# EAGLE board uTTA_V1_Measure (EAGLE 6.3)
VERSION: 1.00
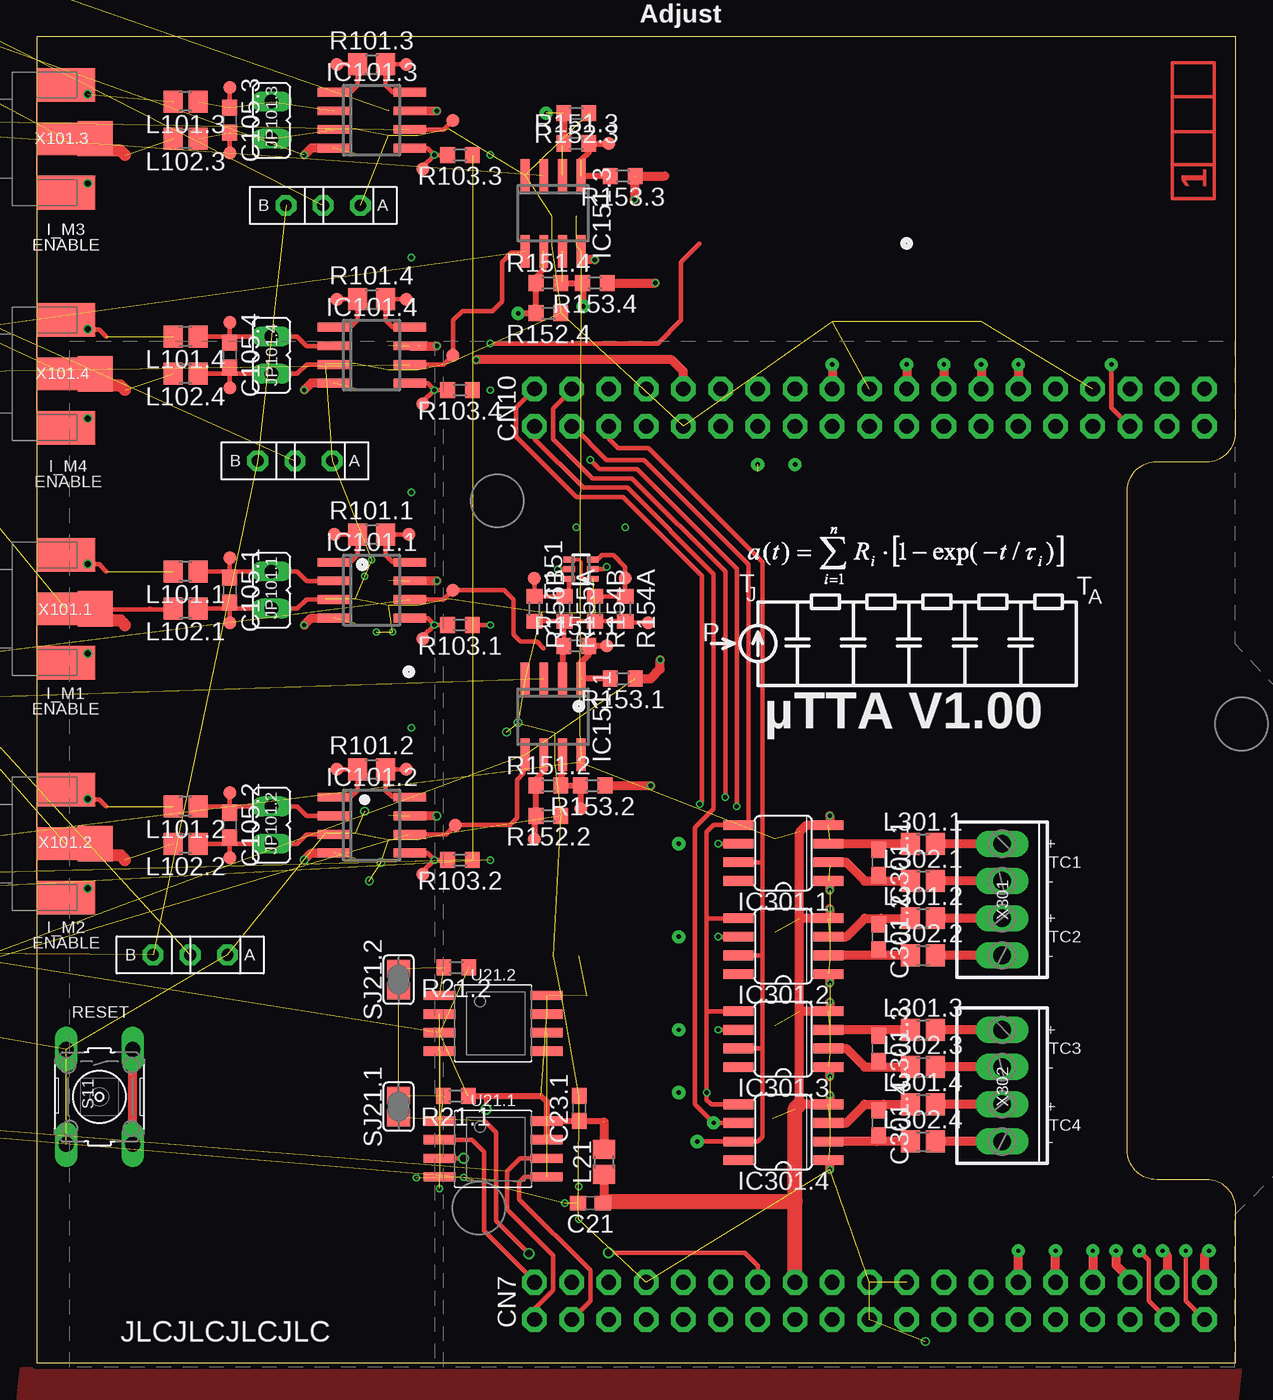
[diagram p5: board, top side]
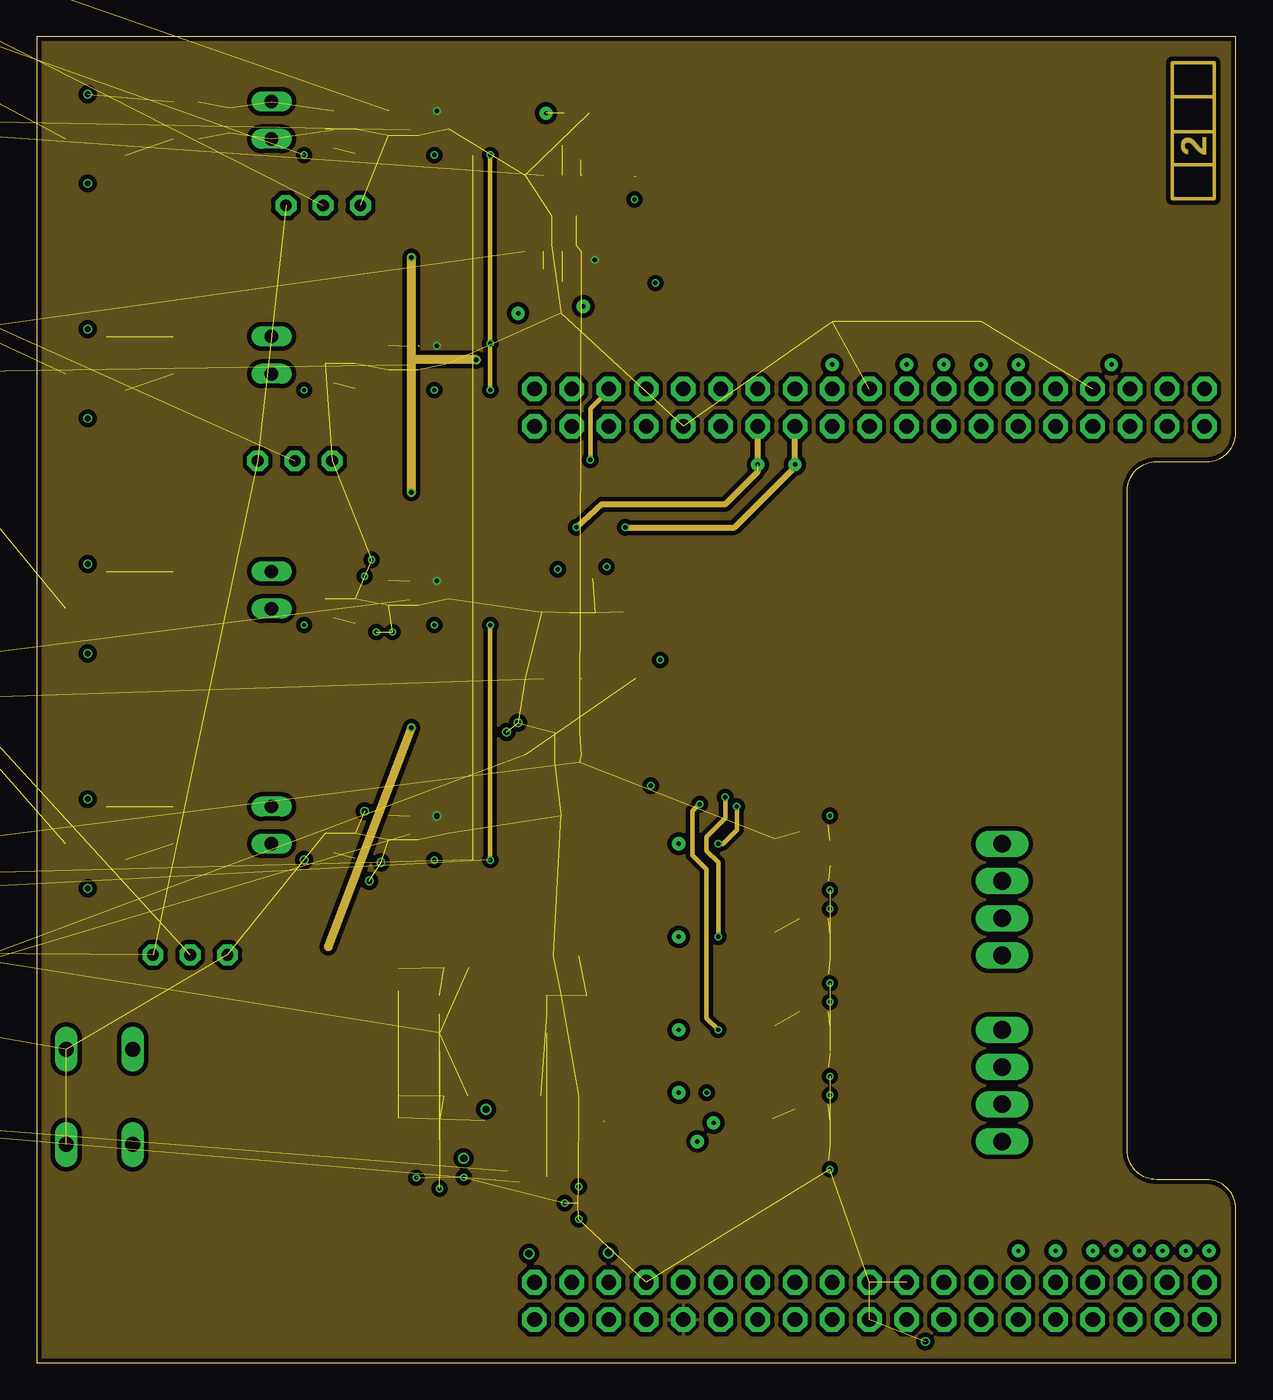
[diagram p6: board, inner layer Route2]
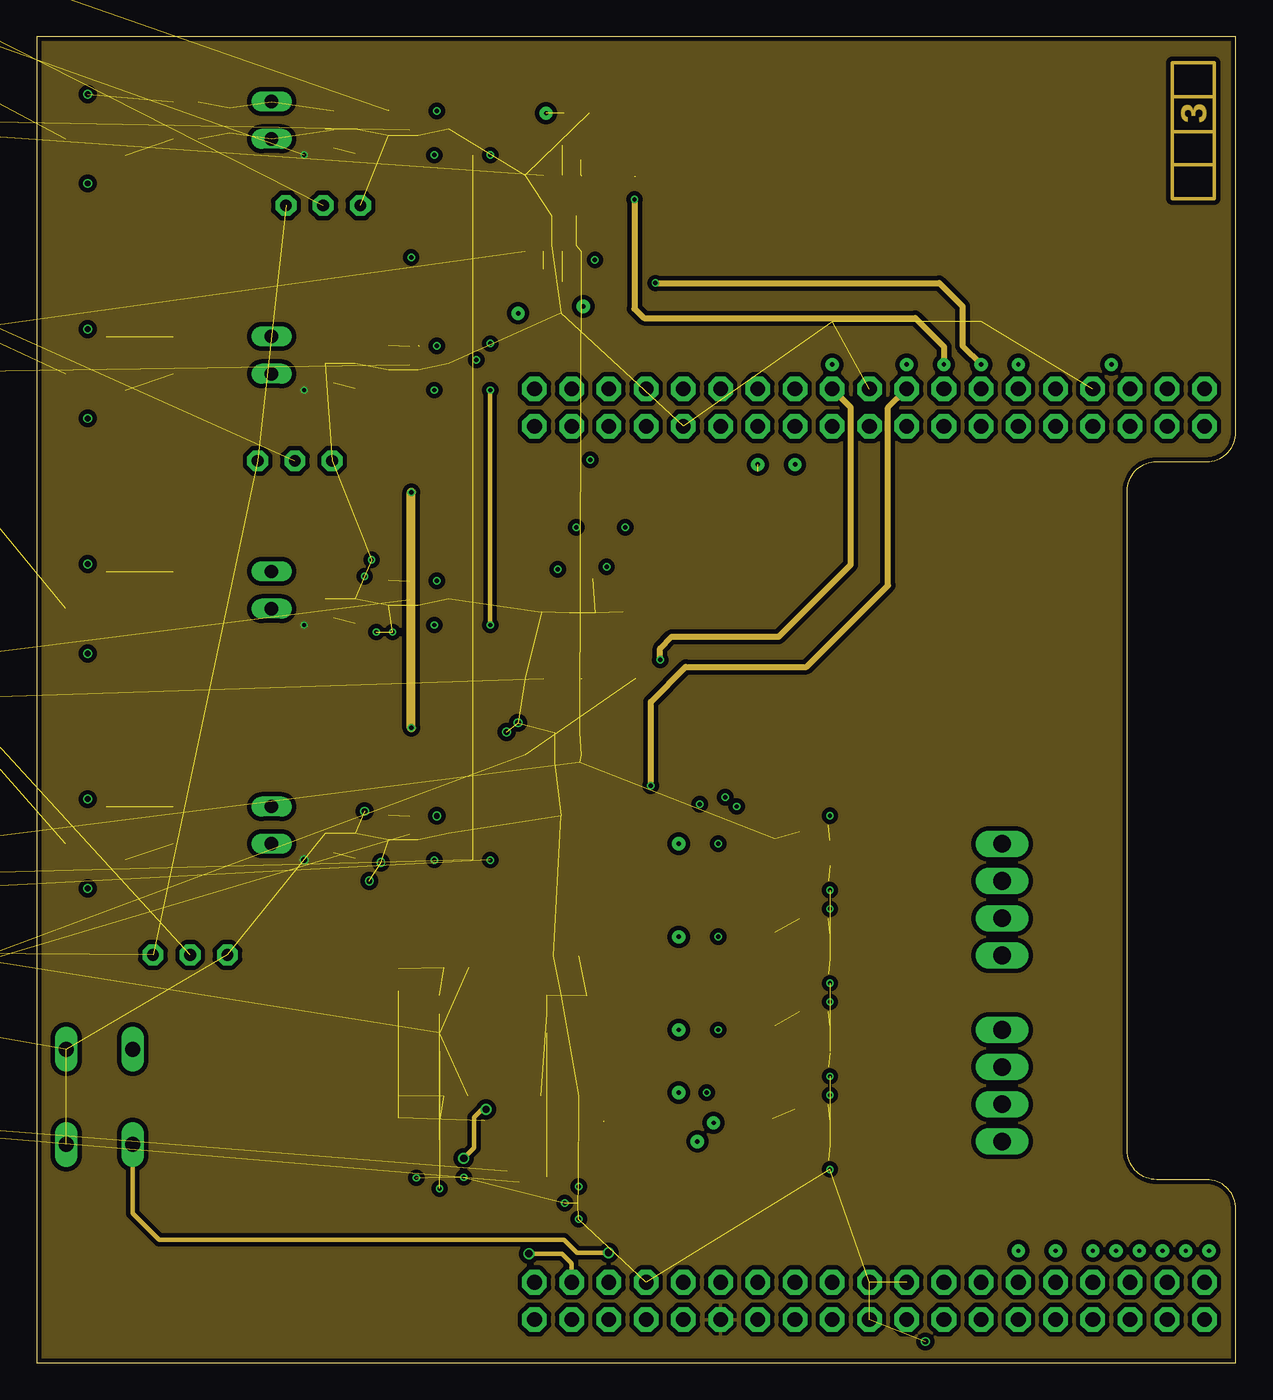
[diagram p7: board, inner layer Route15]
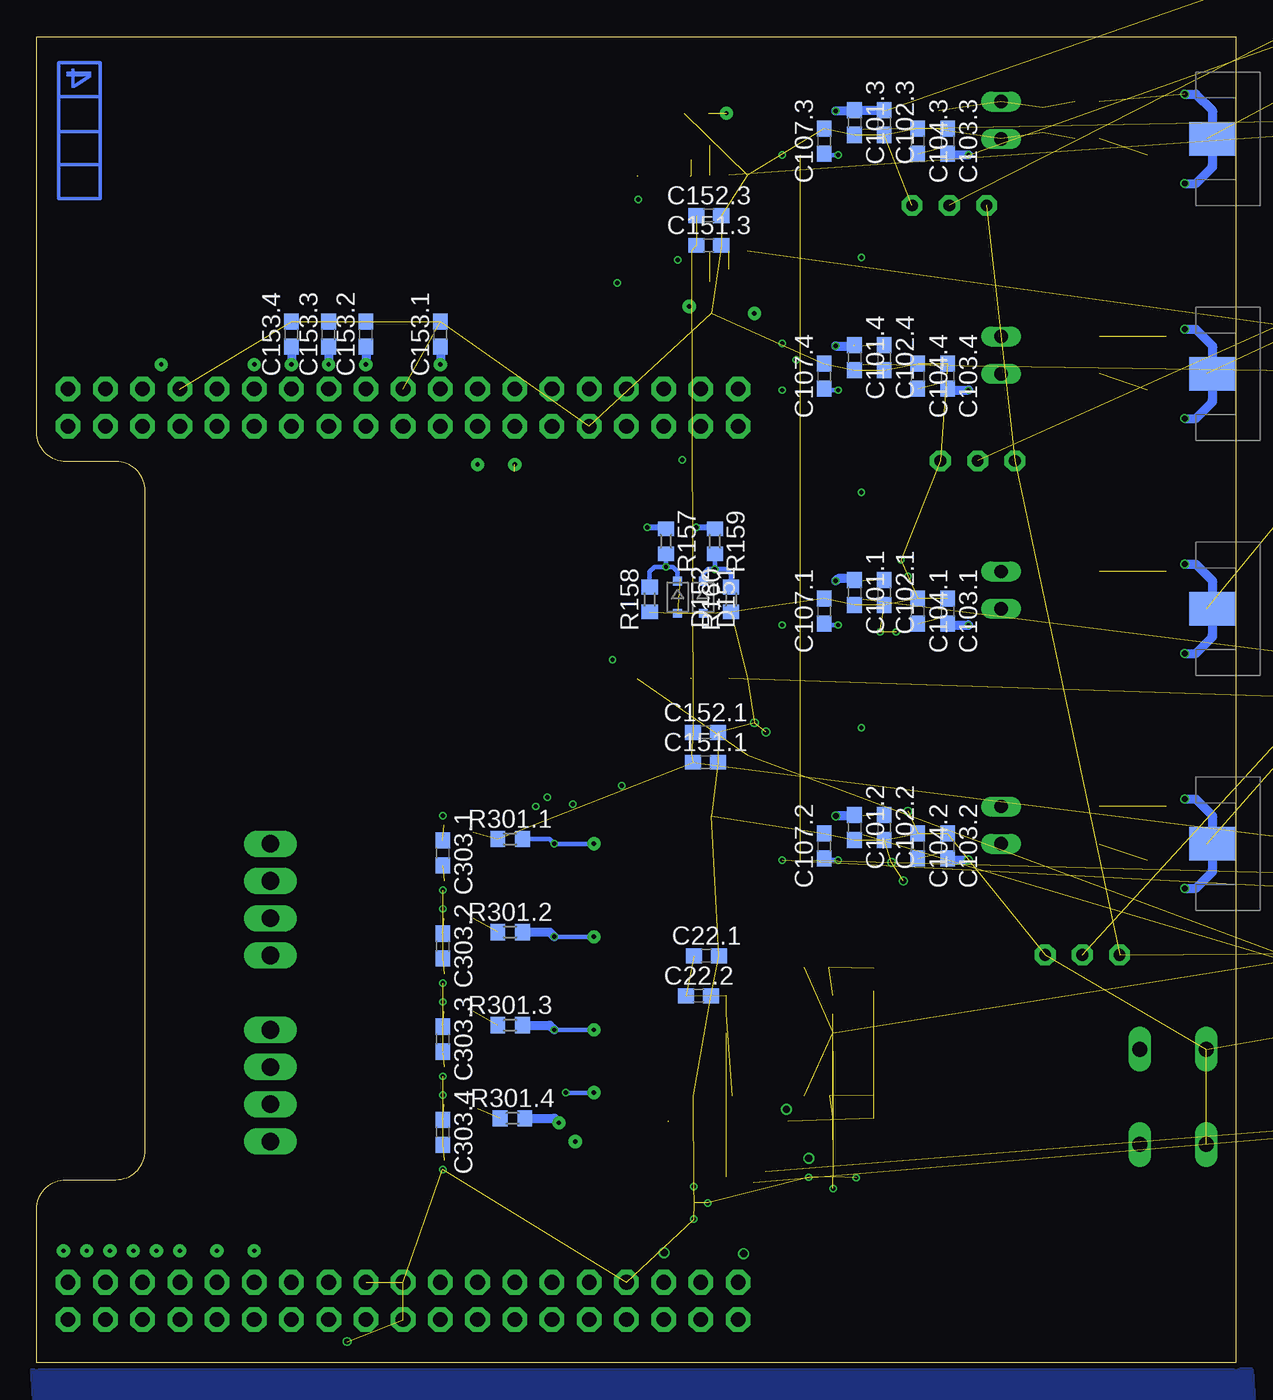
[diagram p8: board, bottom side, seen from below]

Size 81.84 x 90.5 mm. Coordinates in mm from the lower left corner, seen from the top.
Outline: 0,0 81.84,0 81.84,10.5 arc90 79.84,12.5 76.43,12.5 arc-90 74.43,14.5 74.43,59.5 arc-90 76.43,61.5 79.84,61.5 arc90 81.84,63.5 81.84,90.5 0,90.5 0,0
Copper layers (1*2*15*16): Top 0.035mm / dielectric 0.17mm / Route2 0.0175mm / dielectric 47mil / Route15 0.0175mm / dielectric 0.17mm / Bottom 0.035mm
Design rules "JLCPCB_4Layer *": minimum track width 5mil, minimum drill 0.2mm, track to track 5mil, track to pad 0.2mm, pad to pad 5mil, via to via 5mil, smd to smd 0mil, copper to edge 0.2mm, drill to drill 0.5mm, minimum pad ring 4mil, minimum via ring 4mil, stop-mask expansion 3mil, vias tented up to drill 100mil, thermal gap 10mil
Net classes: 0 default: width 0.61 mm, drill 0.3 mm, clearance 0.2 mm; 1 Analog_Sig: width 0.3 mm, drill 0.3 mm, clearance 0.4 mm to class 0, clearance 0.2 mm; 2 Digital_Sig: width 0.3 mm, drill 0.3 mm, clearance 0.4 mm to class 0, clearance 0.3 mm to class 1, clearance 0.2 mm; 3 Power: width 0.5 mm, drill 0.3 mm, clearance 0.4 mm to class 0, clearance 0.4 mm to class 1, clearance 0.4 mm to class 2, clearance 0.2 mm
tRestrict: area 56.5,30.8 to 56.7,32.4; area 56.5,18.1 to 56.7,19.7

## Footprints (pad centres in the part's own frame; a part is rotated, then mirrored left to right if it is on the bottom)
SS_ESP101 = drill 0.8 pad 1.422 octagon: A 2.54,0; B -2.54,0; C 0,0
C0603 = smd 1.1 x 1: 1 -0.85,0; 2 0.85,0
SOD123 = smd 1.4 x 1.4: A 1.9,0; C -1.9,0
SOD323-R = smd 0.6 x 0.6: A 1.1,0; C -1.1,0
MSOP10 = smd 0.25 x 1: 1 -1,-2.113; 2 -0.5,-2.113; 3 0,-2.113; 4 0.5,-2.113; 5 1,-2.113; 6 1,2.113; 7 0.5,2.113; 8 0,2.113; 9 -0.5,2.113; 10 -1,2.113
SO14 = smd 0.6 x 2.2: 1 -3.81,-2.6; 2 -2.54,-2.6; 3 -1.27,-2.6; 4 0,-2.6; 5 1.27,-2.6; 6 2.54,-2.6; 7 3.81,-2.6; 8 3.81,2.6; 9 2.54,2.6; 10 1.27,2.6; 11 0,2.6; 12 -1.27,2.6; 13 -2.54,2.6; 14 -3.81,2.6
TO92- = drill 0.813 long: 1 2.54,0; 2 0,0; 3 -2.54,0
SO08 = smd 0.6 x 2.2: 1 -1.905,-2.6; 2 -0.635,-2.6; 3 0.635,-2.6; 4 1.905,-2.6; 5 1.905,2.6; 6 0.635,2.6; 7 -0.635,2.6; 8 -1.905,2.6
SO08' = smd 0.66 x 2.032: 1 -1.905,-3.073; 2 -0.635,-3.073; 3 0.635,-3.073; 4 1.905,-3.073; 5 1.905,3.073; 6 0.635,3.073; 7 -0.635,3.073; 8 -1.905,3.073
JP1 = drill 0.914 long: 1 0,-1.27; 2 0,1.27
FB2012 = smd 1.3 x 1.5: 1 -0.85,0; 2 0.85,0
R0603 = smd 1 x 1.1: 1 -0.85,0; 2 0.85,0
S64Y = drill 0.813 long: A 2.54,1.27; E -2.54,1.27; S 0,-1.27
R0805 = smd 1.3 x 1.5: 1 -0.95,0; 2 0.95,0
B3F-10XX = drill 1.016 long: 1 -3.251,2.261; 2 3.251,2.261; 3 -3.251,-2.261; 4 3.251,-2.261
SJ = smd 1.168 x 1.6: 1 -0.762,0; 2 0.762,0
SOT363_PHILIPS = smd 0.4 x 0.8: 1 -0.65,-0.8; 2 0,-0.8; 3 0.65,-0.8; 4 0.65,0.8; 5 0,0.8; 6 -0.65,0.8
C90H30 = drill 0.3 pad 0.9: P$1 0,0
C90 = smd 0.9 x 0.9: P$1 0,0
NUCLEO_BRD64_LOWER = drill 1 pad 1.676 octagon: L_3V3 5.79,33.02; L_5V 5.79,30.48; L_BOOT0 3.25,43.18; L_E5V 5.79,45.72; L_GND 5.79,43.18; L_GND3 3.25,27.94; L_GND4 5.79,25.4; L_GND5 5.79,27.94; L_IOREF 5.79,38.1; L_NC1 3.25,38.1; L_NC2 3.25,40.64; L_NC3 5.79,20.32; L_NC4 5.79,40.64; L_PA0 5.79,17.78; L_PA1 5.79,15.24; L_PA4 5.79,12.7; L_PA13 3.25,35.56; L_PA14 3.25,33.02; L_PA15 3.25,30.48; L_PB0 5.79,10.16; L_PB7 3.25,25.4; L_PC0 5.79,5.08; L_PC1 5.79,7.62; L_PC2 3.25,7.62; L_PC3 3.25,5.08; L_PC10 3.25,50.8; L_PC11 5.79,50.8; L_PC12 3.25,48.26; L_PC13 3.25,22.86; L_PC14 3.25,20.32; L_PC15 3.25,17.78; L_PD2 5.79,48.26; L_PF0 3.25,15.24; L_PF1 3.25,12.7; L_RESET 5.79,35.56; L_VBAT 3.25,10.16; L_VDD 3.25,45.72; L_VIN 5.79,22.86; R_AGND 66.75,12.7; R_AVDD 64.21,43.18; R_GND7 64.21,40.64; R_GND8 66.75,27.94; R_NC5 66.75,40.64; R_NC7 66.75,7.62; R_NC8 66.75,5.08; R_PA2 64.21,7.62; R_PA3 64.21,5.08; R_PA5 64.21,38.1; R_PA6 64.21,35.56; R_PA7 64.21,33.02; R_PA8 64.21,22.86; R_PA9 64.21,25.4; R_PA10 64.21,10.16; R_PA11 66.75,35.56; R_PA12 66.75,38.1; R_PB1 66.75,22.86; R_PB2 66.75,25.4; R_PB3 64.21,12.7; R_PB4 64.21,17.78; R_PB5 64.21,15.24; R_PB6 64.21,30.48; R_PB8 64.21,48.26; R_PB9 64.21,45.72; R_PB10 64.21,20.32; R_PB11 66.75,30.48; R_PB12 66.75,33.02; R_PB13 66.75,15.24; R_PB14 66.75,17.78; R_PB15 66.75,20.32; R_PC4 66.75,10.16; R_PC5 66.75,45.72; R_PC6 66.75,48.26; R_PC7 64.21,27.94; R_PC8 66.75,50.8; R_PC9 64.21,50.8; R_U5V 66.75,43.18
SO08W = smd 2.2 x 0.635: 1 -3.651,1.905; 2 -3.651,0.635; 3 -3.651,-0.635; 4 -3.651,-1.905; 5 3.651,-1.905; 6 3.651,-0.635; 7 3.651,0.635; 8 3.651,1.905
BU_SMA_3P = drill 0.4: @GND1 -3.493,-3.045; GND -3.493,3.045 | smd 4 x 2.3: @GND2 -2,-3.68; @GND3 -2,3.68 | smd 3.2 x 2.3 bottom: @GND4 -1.6,0 | smd 4 x 2.2: C1 -2,0 | smd 2.4 x 2.4: C2 -4,0
4POL254 = drill 1.2 long: 1 -3.81,0; 2 -1.27,0; 3 1.27,0; 4 3.81,0

## Placement (x,y rotation side)
51.2  SS_ESP101  [SS_ESP101]  10.47,27.84 0 top
C21  100n/50V  [C0603]  37.78,10.91 180 top
C22.1  1u/25V  [C0603]  36.13,27.77 0 bottom
C22.2  1u/25V  [C0603]  36.67,25.04 0 bottom
C23.1  100n/50V  [C0603]  37.02,17.36 90 top
C23.2  100n/50V  [C0603]  -37.34,32.98 0 top  (outside the outline)
C31  100n/50V  [C0603]  -106.3,28.44 0 top  (outside the outline)
C32  1u/25V  [C0603]  -100.59,30.31 0 top  (outside the outline)
C33  100n/50V  [C0603]  -107,25.42 180 top  (outside the outline)
C34  100n/50V  [C0603]  -163.9,41.2 0 top  (outside the outline)
C41  100n/50V  [C0603]  -180.6,24.76 90 bottom  (outside the outline)
C42  1u/25V  [C0603]  -176.88,29.23 270 bottom  (outside the outline)
C43  100n/50V  [C0603]  -180.47,28.5 90 bottom  (outside the outline)
C44  1u/25V  [C0603]  -176.63,25.42 270 bottom  (outside the outline)
C45.1  100n/50V  [C0603]  -165.55,70.22 0 bottom  (outside the outline)
C45.2  100n/50V  [C0603]  -205.78,65.11 90 top  (outside the outline)
C46  100n/50V  [C0603]  -158.85,54.35 0 top  (outside the outline)
C51.1  100n/50V  [C0603]  -126.4,203.67 180 bottom  (outside the outline)
C51.2  100n/50V  [C0603]  -147.39,202.75 180 bottom  (outside the outline)
C51.3  100n/50V  [C0603]  -147.39,174.36 180 bottom  (outside the outline)
C51.4  100n/50V  [C0603]  -159.45,145.88 0 bottom  (outside the outline)
C52.1  1u/25V  [C0603]  -126.4,201.64 180 bottom  (outside the outline)
C52.2  1u/25V  [C0603]  -147.39,200.72 180 bottom  (outside the outline)
C52.3  1u/25V  [C0603]  -147.39,172.33 180 bottom  (outside the outline)
C52.4  1u/25V  [C0603]  -159.45,135.85 0 bottom  (outside the outline)
C53.1  100n/50V  [C0603]  -124.31,197.57 180 bottom  (outside the outline)
C53.2  100n/50V  [C0603]  -145.29,196.65 180 bottom  (outside the outline)
C53.3  100n/50V  [C0603]  -145.29,168.27 180 bottom  (outside the outline)
C53.4  100n/50V  [C0603]  -159.45,140.87 0 bottom  (outside the outline)
C54.1  1u/25V  [C0603]  -124.31,199.6 180 bottom  (outside the outline)
C54.2  1u/25V  [C0603]  -145.29,198.68 180 bottom  (outside the outline)
C54.3  1u/25V  [C0603]  -145.29,170.3 180 bottom  (outside the outline)
C54.4  1u/25V  [C0603]  -159.45,130.83 0 bottom  (outside the outline)
C101.1  100n/50V  [C0603]  26.03,52.57 270 bottom
C101.2  100n/50V  [C0603]  26.03,36.54 270 bottom
C101.3  100n/50V  [C0603]  26.03,84.64 270 bottom
C101.4  100n/50V  [C0603]  26.03,68.6 270 bottom
C102.1  1u/25V  [C0603]  24,52.57 270 bottom
C102.2  1u/25V  [C0603]  24,36.54 270 bottom
C102.3  1u/25V  [C0603]  24,84.64 270 bottom
C102.4  1u/25V  [C0603]  24,68.6 270 bottom
C103.1  100n/50V  [C0603]  19.68,51.3 270 bottom
C103.2  100n/50V  [C0603]  19.68,35.27 270 bottom
C103.3  100n/50V  [C0603]  19.68,83.37 270 bottom
C103.4  100n/50V  [C0603]  19.68,67.33 270 bottom
C104.1  1u/25V  [C0603]  21.71,51.3 270 bottom
C104.2  1u/25V  [C0603]  21.71,35.27 270 bottom
C104.3  1u/25V  [C0603]  21.71,83.37 270 bottom
C104.4  1u/25V  [C0603]  21.71,67.33 270 bottom
C105.1  10p  [C0603]  13.17,52.73 270 top
C105.2  10p  [C0603]  13.17,36.7 270 top
C105.3  10p  [C0603]  13.17,84.8 270 top
C105.4  10p  [C0603]  13.17,68.76 270 top
C106.1  330p  [C0603]  -37.18,49.2 0 top  (outside the outline)
C106.2  330p  [C0603]  -37.34,22.47 0 top  (outside the outline)
C106.3  330p  [C0603]  -32.39,90.13 0 top  (outside the outline)
C106.4  330p  [C0603]  -35.12,72.13 0 top  (outside the outline)
C107.1  100n/50V  [C0603]  28.09,51.3 90 bottom
C107.2  100n/50V  [C0603]  28.09,35.27 90 bottom
C107.3  100n/50V  [C0603]  28.09,83.37 90 bottom
C107.4  100n/50V  [C0603]  28.09,67.33 90 bottom
C151.1  100n/50V  [C0603]  36.19,40.98 0 bottom
C151.3  100n/50V  [C0603]  35.97,76.26 0 bottom
C152.1  1u/25V  [C0603]  36.19,43.01 0 bottom
C152.3  1u/25V  [C0603]  35.97,78.29 0 bottom
C153.1  1n/25V  [C0603]  54.29,70.19 90 bottom
C153.2  1n/25V  [C0603]  59.37,70.19 90 bottom
C153.3  1n/25V  [C0603]  61.91,70.19 90 bottom
C153.4  1n/25V  [C0603]  64.45,70.19 90 bottom
C301.1  10n/50V  [C0603]  57.46,34.16 270 top
C301.2  10n/50V  [C0603]  57.46,29.07 270 top
C301.3  10n/50V  [C0603]  57.46,21.45 270 top
C301.4  10n/50V  [C0603]  57.46,16.38 270 top
C303.1  100n/50V  [C0603]  54.13,34.79 270 bottom
C303.2  100n/50V  [C0603]  54.13,28.44 270 bottom
C303.3  100n/50V  [C0603]  54.13,22.09 270 bottom
C303.4  100n/50V  [C0603]  54.13,15.74 270 bottom
D51.1  1N4148  [SOD123]  -125.13,208.46 180 bottom  (outside the outline)
D51.2  1N4148  [SOD123]  -146.34,206.46 180 bottom  (outside the outline)
D51.3  1N4148  [SOD123]  -132.34,156.17 180 bottom  (outside the outline)
D51.4  1N4148  [SOD123]  -132.56,130.99 180 bottom  (outside the outline)
D101.1  SD101  [SOD123]  -36.01,54.48 0 top  (outside the outline)
D101.2  SD101  [SOD123]  -36.17,27.74 0 top  (outside the outline)
D101.3  SD101  [SOD123]  -31.22,95.4 0 top  (outside the outline)
D101.4  SD101  [SOD123]  -33.95,77.4 0 top  (outside the outline)
D151  MM3Z3V3T1GR  [SOD323-R]  36.35,52.25 270 bottom
D152  MM3Z3V3T1GR  [SOD323-R]  38.09,52.25 270 bottom
IC4  AD5664R  [MSOP10]  -103.35,21.74 0 top  (outside the outline)
IC41  TL074D  [SO14]  -167.55,26.63 0 top  (outside the outline)
IC42  LT1004CLP-2.5  [TO92-]  -159.87,57.46 0 top  (outside the outline)
IC51.1  OPA2156ID  [SO08]  -125.35,200.62 0 top  (outside the outline)
IC51.2  OPA2156ID  [SO08]  -146.34,199.7 0 top  (outside the outline)
IC51.3  OPA2156ID  [SO08]  -146.34,171.31 0 top  (outside the outline)
IC51.4  OPA2156ID  [SO08]  -146.34,142.93 0 top  (outside the outline)
IC101.1  LT1167  [SO08]  22.85,52.73 270 top
IC101.2  LT1167  [SO08]  22.85,36.7 270 top
IC101.3  LT1167  [SO08]  22.85,84.8 270 top
IC101.4  LT1167  [SO08]  22.85,68.76 270 top
IC151.1  MCP602SN  [SO08]  35.24,44.09 180 top
IC151.3  MCP602SN  [SO08]  35.24,78.45 180 top
IC301.1  MAX6675ISA  [SO08']  50.95,34.79 90 top
IC301.2  MAX6675ISA  [SO08']  50.95,28.44 90 top
IC301.3  MAX6675ISA  [SO08']  50.95,22.09 90 top
IC301.4  MAX6675ISA  [SO08']  50.95,15.74 90 top
JP101.1  [JP1]  16.03,52.73 180 top
JP101.2  [JP1]  16.03,36.7 180 top
JP101.3  [JP1]  16.03,84.8 180 top
JP101.4  [JP1]  16.03,68.76 180 top
L21  FBMMZ2012S  [FB2012]  38.73,13.71 90 top
L31  FBMMZ2012S  [FB2012]  -100.68,27.84 180 top  (outside the outline)
L101.1  FBMMZ2012S  [FB2012]  10.15,54 180 top
L101.2  FBMMZ2012S  [FB2012]  10.15,37.97 180 top
L101.3  FBMMZ2012S  [FB2012]  10.15,86.07 180 top
L101.4  FBMMZ2012S  [FB2012]  10.15,70.03 180 top
L102.1  FBMMZ2012S  [FB2012]  10.15,51.46 180 top
L102.2  FBMMZ2012S  [FB2012]  10.15,35.42 180 top
L102.3  FBMMZ2012S  [FB2012]  10.15,83.53 180 top
L102.4  FBMMZ2012S  [FB2012]  10.15,67.49 180 top
L301.1  FBMMZ2012S  [FB2012]  60.48,35.42 0 top
L301.2  FBMMZ2012S  [FB2012]  60.48,30.34 0 top
L301.3  FBMMZ2012S  [FB2012]  60.48,22.73 0 top
L301.4  FBMMZ2012S  [FB2012]  60.48,17.64 0 top
L302.1  FBMMZ2012S  [FB2012]  60.48,32.88 0 top
L302.2  FBMMZ2012S  [FB2012]  60.48,27.8 0 top
L302.3  FBMMZ2012S  [FB2012]  60.48,20.18 0 top
L302.4  FBMMZ2012S  [FB2012]  60.48,15.11 0 top
R21.1  10k  [R0603]  28.6,18.22 180 top
R21.2  10k  [R0603]  28.63,26.98 180 top
R31  10k  [R0603]  -96.21,24 0 top  (outside the outline)
R32  1k  [R0603]  -167.01,43.3 0 top  (outside the outline)
R33  1k  [R0603]  -167.01,41.24 0 top  (outside the outline)
R34  1k  [S64Y]  -171.45,41.24 90 top  (outside the outline)
R41  1k  [R0603]  -161.93,54.35 180 bottom  (outside the outline)
R41.1  1k  [S64Y]  -180.38,69.78 0 top  (outside the outline)
R41.2  1k  [S64Y]  -203.71,69.62 0 top  (outside the outline)
R42.1  1k  [R0603]  -171.8,69.97 0 top  (outside the outline)
R42.2  1k  [R0603]  -203.71,65.11 270 top  (outside the outline)
R43.1  1k  [R0603]  -174.73,63.59 90 top  (outside the outline)
R43.2  1k  [R0603]  -201.68,65.11 270 top  (outside the outline)
R44.1  10k  [R0603]  -173.01,73.62 0 top  (outside the outline)
R44.2  10k  [R0603]  -197.14,64.73 180 top  (outside the outline)
R45.1  2k  [R0603]  -168.15,67.02 90 top  (outside the outline)
R45.2  2k  [R0603]  -194,64.7 180 top  (outside the outline)
R46.1  5k6  [R0603]  -207.05,-51.25 0 top  (outside the outline)
R46.2  5k6  [R0603]  -207.05,-56.17 0 top  (outside the outline)
R51.1  10k  [R0603]  -123.54,193.51 180 top  (outside the outline)
R51.2  10k  [R0603]  -142.44,195.83 90 top  (outside the outline)
R51.3  10k  [R0603]  -149.2,165.19 0 top  (outside the outline)
R51.4  10k  [R0603]  -149.2,136.8 0 top  (outside the outline)
R52.1  1k  [R0603]  -123.54,195.54 0 top  (outside the outline)
R52.2  1k  [R0603]  -142.44,199.76 90 top  (outside the outline)
R52.3  1k  [R0603]  -142.98,165.19 0 top  (outside the outline)
R52.4  1k  [R0603]  -142.98,136.8 0 top  (outside the outline)
R53.1  10k  [R0603]  -126.56,193.51 0 top  (outside the outline)
R53.2  10k  [R0603]  -147.39,192.78 0 top  (outside the outline)
R53.3  10k  [R0603]  -136.75,165.19 0 top  (outside the outline)
R53.4  10k  [R0603]  -136.75,136.8 0 top  (outside the outline)
R54.1  1k  [R0603]  -126.56,195.54 180 top  (outside the outline)
R54.2  1k  [R0603]  -147.39,194.81 180 top  (outside the outline)
R54.3  1k  [R0603]  -149.2,160.42 0 top  (outside the outline)
R54.4  1k  [R0603]  -149.2,132.04 0 top  (outside the outline)
R55.1  22R  [R0805]  -125.45,205.83 0 top  (outside the outline)
R55.2  22R  [R0805]  -146.79,204.56 0 top  (outside the outline)
R55.3  22R  [R0805]  -139.9,176.74 0 top  (outside the outline)
R55.4  22R  [R0805]  -139.9,148.36 0 top  (outside the outline)
R101.1  49k4  [R0805]  22.85,56.54 0 top
R101.2  49k4  [R0805]  22.85,40.51 0 top
R101.3  49k4  [R0805]  22.85,88.61 0 top
R101.4  49k4  [R0805]  22.85,72.57 0 top
R102.1  1k  [R0603]  -37.18,44.31 0 top  (outside the outline)
R102.2  1k  [R0603]  -37.34,17.58 0 top  (outside the outline)
R102.3  1k  [R0603]  -32.39,85.24 0 top  (outside the outline)
R102.4  1k  [R0603]  -35.12,67.24 0 top  (outside the outline)
R103.1  10R  [R0603]  28.89,50.35 180 top
R103.2  10R  [R0603]  28.89,34.31 180 top
R103.3  10R  [R0603]  28.89,82.42 180 top
R103.4  10R  [R0603]  28.89,66.38 180 top
R151.1  24k9  [R0603]  36.82,48.92 0 top
R151.2  24k9  [R0603]  34.92,39.39 0 top
R151.3  24k9  [R0603]  36.82,83.21 0 top
R151.4  24k9  [R0603]  34.92,73.68 0 top
R152.2  10k  [R0603]  34.92,37.33 180 top
R152.3  10k  [R0603]  36.82,85.27 180 top
R152.4  10k  [R0603]  34.92,71.62 180 top
R153.1  330R  [R0603]  40,46.7 180 top
R153.2  330R  [R0603]  37.94,39.39 180 top
R153.3  330R  [R0603]  40,80.99 180 top
R153.4  330R  [R0603]  38.09,73.68 180 top
R154A  100k  [R0603]  40.16,51.46 270 top
R154B  100k  [R0603]  38.09,51.46 270 top
R155A  15K  [R0603]  36.03,51.46 270 top
R156B  DNP  [R0603]  33.97,51.46 270 top
R157  4k7  [R0603]  38.89,56.06 270 bottom
R158  100k  [R0603]  40,52.09 90 bottom
R159  4k7  [R0603]  35.55,56.06 270 bottom
R160  100k  [R0603]  34.44,52.09 90 bottom
R301.1  10k  [R0603]  49.52,35.74 0 bottom
R301.2  10k  [R0603]  49.52,29.39 0 bottom
R301.3  10k  [R0603]  49.52,23.04 0 bottom
R301.4  10k  [R0603]  49.37,16.69 0 bottom
S11  [B3F-10XX]  4.28,18.15 270 top
S51.3  SS_ESP101  [SS_ESP101]  19.55,78.99 0 top
S51.4  SS_ESP101  [SS_ESP101]  17.62,61.56 0 top
SJ21.1  [SJ]  24.7,17.49 90 top
SJ21.2  [SJ]  24.7,26.15 90 top
T151  BSS138PS  [SOT363_PHILIPS]  37.14,54.16 90 top
TP3  TPC90H30  [C90H30]  78.42,7.64 0 top
TP4  TPC90H30  [C90H30]  75.24,7.64 0 top
TP5  TPC90H30  [C90H30]  76.83,7.64 0 top
TP6  TPC90H30  [C90H30]  80,7.64 0 top
TP7  TPC90H30  [C90H30]  73.66,7.64 0 top
TP8  TPC90H30  [C90H30]  72.07,7.64 0 top
TP9  TPC90H30  [C90H30]  69.53,7.64 0 top
TP10  TPC90H30  [C90H30]  66.99,7.64 0 top
TP11  TPC90H30  [C90H30]  73.34,68.13 0 top
TP12  TPC90H30  [C90H30]  66.99,68.13 0 top
TP17  TPC90H30  [C90H30]  51.75,61.3 0 top
TP18  TPC90H30  [C90H30]  49.21,61.3 0 top
TP19  TPC90H30  [C90H30]  46.19,16.38 0 top
TP20  TPC90H30  [C90H30]  43.81,18.44 0 top
TP21  TPC90H30  [C90H30]  45.08,15.11 0 top
TP22  TPC90H30  [C90H30]  43.81,22.73 0 top
TP23  TPC90H30  [C90H30]  43.81,29.07 0 top
TP24  TPC90H30  [C90H30]  43.81,35.42 0 top
TP31  TP  [C90]  -111.26,25.17 0 top  (outside the outline)
TP32  TP  [C90]  -96.94,15.61 0 top  (outside the outline)
TP41  TP  [C90]  -168.88,21.9 0 top  (outside the outline)
TP42  TP  [C90]  -167.39,72.89 270 top  (outside the outline)
TP43  TP  [C90]  -164.85,43.27 0 top  (outside the outline)
TP44  TP  [C90]  -171.36,31.55 0 top  (outside the outline)
TP45.1  TP  [C90]  -161.96,70.06 270 top  (outside the outline)
TP45.2  TP  [C90]  -207.36,64.22 0 top  (outside the outline)
TP46.1  TP  [C90]  -172.66,66.92 180 top  (outside the outline)
TP46.2  TP  [C90]  -195.36,62.38 0 top  (outside the outline)
TP47.1  TP  [C90]  -165.52,66.19 0 top  (outside the outline)
TP47.2  TP  [C90]  -189.62,64.83 0 top  (outside the outline)
TP51.1  TP  [C90]  -117.73,197.92 270 top  (outside the outline)
TP51.2  TP  [C90]  -142.44,197.79 0 top  (outside the outline)
TP51.3  TP  [C90]  -141.07,160.46 0 top  (outside the outline)
TP51.4  TP  [C90]  -141.07,132.07 0 top  (outside the outline)
TP52.1  TP  [C90]  -125.99,190.56 270 top  (outside the outline)
TP52.2  TP  [C90]  -145.42,192.78 0 top  (outside the outline)
TP52.3  TP  [C90]  -147.29,155.69 0 top  (outside the outline)
TP52.4  TP  [C90]  -147.29,127.31 0 top  (outside the outline)
TP53.1  TP  [C90]  -121.19,203.54 270 top  (outside the outline)
TP53.2  TP  [C90]  -142.4,201.99 0 top  (outside the outline)
TP53.3  TP  [C90]  -140.44,155.69 0 top  (outside the outline)
TP53.4  TP  [C90]  -140.44,127.31 0 top  (outside the outline)
TP54.1  TP  [C90]  -133.51,193.76 270 top  (outside the outline)
TP54.2  TP  [C90]  -149.36,194.81 0 top  (outside the outline)
TP54.3  TP  [C90]  -147.29,152.36 0 top  (outside the outline)
TP54.4  TP  [C90]  -147.29,123.98 0 top  (outside the outline)
TP55.1  TP  [C90]  -120.56,207.38 270 top  (outside the outline)
TP55.2  TP  [C90]  -144.25,204.56 0 top  (outside the outline)
TP55.3  TP  [C90]  -140.44,152.36 0 top  (outside the outline)
TP55.4  TP  [C90]  -140.44,123.98 0 top  (outside the outline)
TP101.1  TP  [C90]  13.17,54.95 0 top
TP101.2  TP  [C90]  13.17,38.92 0 top
TP101.3  TP  [C90]  13.17,87.02 0 top
TP101.4  TP  [C90]  13.17,70.98 0 top
TP102.1  TP  [C90]  13.17,50.51 180 top
TP102.2  TP  [C90]  13.17,34.47 180 top
TP102.3  TP  [C90]  13.17,82.57 0 top
TP102.4  TP  [C90]  13.17,66.54 0 top
TP103.1  TP  [C90]  20.31,56.54 0 top
TP103.2  TP  [C90]  20.47,40.51 0 top
TP103.3  TP  [C90]  20.47,88.61 0 top
TP103.4  TP  [C90]  20.47,72.57 0 top
TP104.1  TP  [C90]  25.39,56.54 0 top
TP104.2  TP  [C90]  25.24,40.51 0 top
TP104.3  TP  [C90]  25.24,88.61 0 top
TP104.4  TP  [C90]  25.24,72.57 0 top
TP105.1  TP  [C90]  28.41,52.73 180 top
TP105.2  TP  [C90]  28.57,36.7 0 top
TP105.3  TP  [C90]  28.41,84.8 0 top
TP105.4  TP  [C90]  28.41,68.76 0 top
TP106.1  TPC90H30  [C90H30]  -129.1,207.16 270 top  (outside the outline)
TP106.2  TPC90H30  [C90H30]  -30.68,17.61 0 top  (outside the outline)
TP106.3  TPC90H30  [C90H30]  -25.15,85.27 0 top  (outside the outline)
TP106.4  TPC90H30  [C90H30]  -28.45,67.27 0 top  (outside the outline)
TP107.1  TP  [C90]  26.35,49.4 180 top
TP107.2  TP  [C90]  26.35,33.36 0 top
TP107.3  TP  [C90]  26.35,81.46 0 top
TP107.4  TP  [C90]  26.35,65.43 0 top
TP151.1  TP  [C90]  38.89,48.92 0 top
TP151.2  TP  [C90]  37.14,37.81 0 top
TP151.3  TP  [C90]  39.05,83.21 0 top
TP151.4  TPC90H30  [C90H30]  37.3,72.1 0 top
TP152.1  TP  [C90]  41.75,50.51 0 top
TP152.2  TP  [C90]  33.97,35.74 0 top
TP152.3  TPC90H30  [C90H30]  34.76,85.27 0 top
TP152.4  TPC90H30  [C90H30]  32.86,71.62 0 top
TP153  TP  [C90]  40.16,53.52 90 top
TP153.1  TPC90H30  [C90H30]  54.29,68.13 0 top
TP153.2  TPC90H30  [C90H30]  59.37,68.13 0 top
TP153.3  TPC90H30  [C90H30]  61.91,68.13 0 top
TP153.4  TPC90H30  [C90H30]  64.45,68.13 0 top
TP154  TP  [C90]  33.97,53.52 90 top
U11  NUCLEO_F103_BOT  [NUCLEO_BRD64_LOWER]  84.77,-0.29 90 top
U21.1  W25Q512JV  [SO08W]  31.14,14.6 0 top
U21.2  W25Q512JV  [SO08W]  31.14,23.17 0 top
U$1  [A4_LOC_CC_BY_NC_SA]  -81.09,-47.76 0 top  (outside the outline)
U$2  A4L-LOC_CC_BY_NC_SA  [A4_LOC_CC_BY_NC_SA]  -81.09,-47.76 0 top  (outside the outline)
U$3  A4L-LOC_CC_BY_NC_SA  [A4_LOC_CC_BY_NC_SA]  -81.09,-47.76 0 top  (outside the outline)
U$4  A4L-LOC_CC_BY_NC_SA  [A4_LOC_CC_BY_NC_SA]  -81.09,-47.76 0 top  (outside the outline)
U$9  A4L-LOC_CC_BY_NC_SA  [A4_LOC_CC_BY_NC_SA]  -81.09,-47.76 0 top  (outside the outline)
U$10  A4L-LOC_CC_BY_NC_SA  [A4_LOC_CC_BY_NC_SA]  -81.09,-47.76 0 top  (outside the outline)
X101.1  BU-SMA-GSPECIAL  [BU_SMA_3P]  -0.01,51.46 180 top
X101.2  BU-SMA-GSPECIAL  [BU_SMA_3P]  -0.01,35.42 180 top
X101.3  BU-SMA-GSPECIAL  [BU_SMA_3P]  -0.01,83.53 180 top
X101.4  BU-SMA-GSPECIAL  [BU_SMA_3P]  -0.01,67.49 180 top
X301  [4POL254]  65.88,31.61 270 top
X302  [4POL254]  65.88,18.91 270 top

## Tracks (layer width: path | path; a pad name or v marks a point on that pad's centre or on a via)
!DAC_SPI_CSN_DO  (2 unrouted)
!SD_SPI_CSN_DO  (via drill 0.5)  (2 unrouted)
  Top 0.305: v33.59,7.45 31.33,9.71 31.33,15.74 30.57,16.5
  Route15 0.305: U11.L_PD2 36.51,6.79 35.84,7.45 v33.59,7.45
!TEMP_SPI_CSN0_DO  (via drill 0.3)
  Top 0.3: v37.78,61.62 38.41,60.98 40.95,60.98 47.78,54.16 v47.78,37.97 | v46.51,35.42 IC301.1.6
  Route2 0.3: U11.R_PC5 39.05,66.38 37.78,65.11 v37.78,61.62 | v47.78,37.97 47.78,36.38 46.83,35.42 v46.51,35.42
  Bottom 0.3: R301.1.2 46.83,35.74 v46.51,35.42 TP24.P$1
!TEMP_SPI_CSN1_DO  (via drill 0.3)
  Top 0.3: v46.51,29.07 IC301.2.6 | U11.R_PC6 36.51,66.38 35.24,65.11 35.24,63.05 37.94,60.35 40.63,60.35 46.98,54 v46.98,38.6
  Route2 0.3: v46.98,38.6 46.98,37.17 45.71,35.9 45.71,34.95 46.51,34.16 v46.51,29.07
  Bottom 0.3: TP23.P$1 v46.51,29.07
  Bottom 0.61: R301.2.2 46.83,29.39 v46.51,29.07
!TEMP_SPI_CSN2_DO  (via drill 0.3)
  Top 0.3: v46.51,22.73 IC301.3.6 | U11.R_PC8 32.7,65.19 32.7,63.21 36.82,59.08 40,59.08 45.4,53.68 45.4,38.28 v45.24,38.12
  Route2 0.3: v45.24,38.12 44.76,37.65 44.76,34.63 45.71,33.68 45.71,23.52 v46.51,22.73
  Bottom 0.3: TP22.P$1 v46.51,22.73
  Bottom 0.61: R301.3.2 46.83,23.04 v46.51,22.73
!TEMP_SPI_CSN3_DO
  Top 0.3: U11.R_PC9 33.97,63.05 37.3,59.71 40.32,59.71 46.19,53.84 46.19,37.81 44.92,36.54 44.92,17.64 TP19.P$1 IC301.4.6
  Bottom 0.61: R301.4.2 46.51,16.69 TP19.P$1
+3V3  (via drill 0.3)  (17 unrouted)
  Top 0.61: IC301.4.4 54.13,17.75 v54.13,18.28 54.13,17.8 53.97,17.64 52.06,17.64 52.06,24 | IC301.3.4 54.13,24.1 v54.13,24.63 54.13,24 52.06,24 | IC301.2.4 54.13,30.45 v54.13,30.98 54.13,30.34 52.06,30.34 | v54.13,37.33 54.13,36.8 IC301.1.4 52.54,36.7 52.06,36.22 52.06,30.34 | 38.73,11.02 C21.1 38.73,10.81 38.73,11.02 | 52.06,24 52.06,30.34 | L21.1 38.73,11.02
  Top 1.016: U11.L_3V3 51.75,11.04 | 51.75,11.04 51.75,17.33 52.06,17.64 | 51.75,11.04 arc-45 51.67,11.01 45.81,11.01 44.52,11.02 38.73,11.02
  Bottom 0.61: R301.4.1 | 54.13,23.04 C303.3.1 | R301.3.1 | R301.2.1 | R301.1.1
+5V  (via drill 0.3, 0.4)  (21 unrouted)
  Top 0.61: v27.3,53.36 IC101.1.7 | v27.3,37.33 IC101.2.7 | IC101.4.7 v27.3,69.4 | v38.1,75.27 37.14,75.27 | IC101.3.7 v27.3,85.43
  Bottom 0.61: C101.1.1 25.93,53.52 27.14,53.52 v27.3,53.36 | 25.93,37.49 C101.2.1 26.03,37.33 v27.3,37.33 | v27.3,69.4 26.09,69.4 | v27.3,85.43 26.09,85.43 C101.3.1 25.97,85.43 23.97,85.43
  pour Route2 (isolate 0.305): -1,91.5 82.07,91.5 82.07,-0.5 -1,-0.5
+5V/4  (via drill 0.5)  (8 unrouted)
  Top 0.305: U21.1.3 v29.14,13.96 | v30.67,17.3 30.67,18.15 30.69,18.22 R21.1.1
  Top 0.406: R21.1.1 34.38,18.22 34.79,17.84 U21.1.8 | U21.1.8 U21.1.7 | U21.1.8 C23.1.1 38.73,16.51
  Top 0.61: 38.73,16.45 L21.2
  Route15 0.305: v29.14,13.96 29.84,14.66 29.84,16.76 30.38,17.3 v30.67,17.3
+15V  (via drill 0.3)
  Top 0.406: 25.52,43.36 v25.55,43.33
  Top 0.61: U11.R_NC5 44.13,67.65 43.33,68.44 v30,68.44
  Route2 0.61: v25.55,43.33 19.9,28.41 | v25.55,75.43 25.55,68.29 | 25.55,68.29 v25.55,59.4 | 25.55,68.29 25.71,68.44 v30,68.44
  Route15 0.61: v25.55,43.33 v25.55,59.4
-5V  (via drill 0.3, 0.4)  (19 unrouted)
  Top 0.61: v18.25,50.35 18.73,50.82 IC101.1.4 | v18.25,34.31 18.73,34.79 IC101.2.4 | IC101.4.4 18.73,66.86 v18.25,66.38 | IC101.3.4 18.73,82.89 v18.25,82.42
  Bottom 0.61: C103.1.2 19.78,50.35 v18.25,50.35 | C103.2.2 19.78,34.32 19.68,34.32 19.68,34.31 v18.25,34.31 | v18.25,82.42 19.58,82.42 C103.3.2 19.78,82.42 | v18.25,66.38 19.68,66.38 C103.4.2 19.78,66.38
  pour Route15 (isolate 0.305): -1,91.5 82.07,91.5 82.07,-0.5 -1,-0.5
AGND  (via drill 0.3, 0.4)  (124 unrouted)
  Top 0.254: T151.1 37.32,53.51 37.14,53.68 37.14,54.63 36.97,54.81 T151.4
  Top 0.61: v54.13,13.2 54.13,13.73 IC301.4.1 | v54.13,19.55 54.13,20.08 IC301.3.1 | v54.13,25.9 54.13,26.43 IC301.2.1 | v54.13,32.25 54.13,32.78 IC301.1.1
  Bottom 0.61: 54.13,21.14 C303.3.2
  other vias: 22.7,32.88 23.17,49.87 22.38,37.65 23.49,34.16 32.86,43.68 22.38,53.68 22.85,54.79 32.06,43.05 60.64,1.45 24.28,49.87 27.49,11.9 29.14,12.66 36.03,10.91 36.98,9.8 36.98,12.03 25.9,12.63
  pour Top (isolate 0.406): -2.87,-16.83 80.2,-16.83 82.07,-0.5 -1,-0.5
  pour Bottom (isolate 0.406): -1.44,-7.02 81.62,-7.02 82.07,-0.5 -1,-0.5
AMP1_OUT  (1 unrouted)
  Top 0.406: R153.1.2 37.2,46.7 | TP151.1.P$1 R151.1.2 37.67,48.34 37.14,47.81 IC151.1.1
AMP1_RG_B0
  Top 0.305: T151.6 36.34,52.62 R155A.1 R156B.1 TP154.P$1
AMP1_RG_B1
  Top 0.305: T151.3 38.27,54.81 38.57,55.11 39.37,55.11 40.16,54.32 TP153.P$1 R154A.1 R154B.1
AMP2_FB
  Top 0.406: TP152.2.P$1 33.97,37.17 R152.2.2 R151.2.1 34.13,39.45 34.13,39.87 34.6,40.35 IC151.1.6
AMP2_OUT
  Top 0.406: 35.87,39.5 R151.2.2 | R151.2.2 R153.2.2 37.14,39.34 TP151.2.P$1 | IC151.1.7 35.87,40.16 35.77,40.05 R151.2.2
AMP3_FB  (2 unrouted)
  Top 0.406: 35.87,83.11 R151.3.1 R152.3.2
AMP3_OUT  (2 unrouted)
  Top 0.406: 37.14,82.1 37.67,82.63 R151.3.2 TP151.3.P$1 | R153.3.2 37.2,80.99
AMP4_FB  (1 unrouted)
  Top 0.406: TP152.4.P$1 R152.4.2 R151.4.1 34.07,74.1 34.6,74.64
AMP4_OUT  (1 unrouted)
  Top 0.406: 35.87,73.79 R151.4.2 R153.4.2 37.3,73.63 TP151.4.P$1
B0_GATE  (via drill 0.3)
  Top 0.305: T151.5 v35.56,54.16
  Bottom 0.305: R160.2 34.44,53.84 34.76,54.16 v35.56,54.16 | D151.C 36.35,53.84 36.03,54.16 v35.56,54.16 | R159.2 v35.56,54.16
B1_GATE  (via drill 0.3)
  Top 0.305: T151.2 38.73,54.16 v38.89,54.32
  Bottom 0.3: R157.2 v38.89,54.32
  Bottom 0.305: D152.C 38.1,54 38.41,54.32 v38.89,54.32 39.68,54.32 40,54 R158.2
CH1_OFFS  (1 unrouted)
CH2_4_OFFS  (1 unrouted)
CURR_MEAS_AI
  Top 0.61: TP12.P$1 U11.R_PB14
DBG_IO1
  Top 0.61: TP6.P$1 79.69,7.33 U11.L_PC0
DBG_IO2
  Top 0.61: TP5.P$1 77.15,7.33 U11.L_PC1
DBG_IO3
  Top 0.305: TP4.P$1 75.88,7.01 75.88,4.23 U11.L_PC2
DBG_IO4
  Top 0.305: TP3.P$1 78.42,4.23 U11.L_PC3
DIFF_AMP1_OUT  (1 unrouted)
  Top 0.3: 34.6,48.76 34.13,49.24 33.01,49.24 32.54,49.71 32.54,52.09 31.9,52.73 TP105.1.P$1
  Top 0.305: IC101.1.6 27.78,52.09 TP105.1.P$1
DIFF_AMP2_OUT  (1 unrouted)
  Top 0.3: TP105.2.P$1 32.29,36.7 32.76,37.17 32.76,39.79 33.24,40.27 33.23,41.46
  Top 0.305: IC101.2.6 27.93,36.06 TP105.2.P$1
DIFF_AMP3_OUT  (1 unrouted)
  Top 0.305: IC101.3.6 27.78,84.16 TP105.3.P$1
DIFF_AMP4_OUT  (1 unrouted)
  Top 0.3: TP105.4.P$1 28.41,71.14 29.05,71.78 31.11,71.78 31.75,72.41 31.75,75.11 32.38,75.75 33.49,75.75
  Top 0.305: IC101.4.6 27.78,68.13 TP105.4.P$1
DIODE2_IN  (via drill 0.3)  (5 unrouted)
  Top 0.61: TP153.1.P$1 U11.R_PB11 | R153.1.1 41.9,46.7 42.54,47.33 v42.54,47.97
  Route15 0.406: v42.54,47.97 42.54,48.76 43.33,49.55 50.64,49.55 55.56,54.48 55.56,65.19 U11.R_PB11
  Bottom 0.61: C153.1.1 TP153.1.P$1
DIODE2_OUT_AI  (via drill 0.3)
  Top 0.61: TP153.2.P$1 U11.R_PB2 | R153.2.1 v41.9,39.39 v41.9,39.4
  Route15 0.406: v41.9,39.39 41.9,45.11 44.29,47.49 52.54,47.49 58.1,53.05 58.1,65.19 U11.R_PB2
  Bottom 0.61: C153.2.1 TP153.2.P$1
DIODE3_IN  (4 unrouted)
DIODE3_OUT_AI  (via drill 0.3)  (1 unrouted)
  Top 0.61: TP153.3.P$1 U11.R_PB1 | R153.3.1 42.85,80.99 | 40.8,80.98 40.79,80.99 v40.79,79.4
  Route15 0.406: v40.79,79.4 40.79,71.94 41.43,71.3 59.95,71.3 C153.3.1 TP153.3.P$1
  Bottom 0.61: C153.3.1 TP153.3.P$1
DIODE4_IN  (4 unrouted)
DIODE4_OUT_AI  (via drill 0.3)
  Top 0.61: TP153.4.P$1 U11.R_PB15 | v42.22,73.69 v42.22,73.68 R153.4.1
  Route15 0.406: v42.22,73.68 61.59,73.68 63.18,72.1 63.18,69.4 TP153.4.P$1
  Bottom 0.61: C153.4.1 TP153.4.P$1
GAIN1+
  Top 0.305: IC101.1.8 24.28,54.63 23.81,55.11 R101.1.2 | TP104.1.P$1 R101.1.2
  Top 0.61: R101.1.2
GAIN1-
  Top 0.305: IC101.1.1 21.43,54.63 21.9,55.11 R101.1.1 | TP103.1.P$1 R101.1.1
  Top 0.61: R101.1.1
GAIN2+
  Top 0.3: TP104.2.P$1 R101.2.2 23.81,40.66
  Top 0.305: IC101.2.8 24.28,38.6 23.81,39.08 23.81,40.66
GAIN2-
  Top 0.3: 21.9,40.66 R101.2.1
  Top 0.305: IC101.2.1 21.43,38.6 21.9,39.08 21.9,40.66 | TP103.2.P$1 R101.2.1
GAIN3+
  Top 0.305: IC101.3.8 24.28,86.7 23.81,87.18 23.81,88.76 R101.3.2 TP104.3.P$1
GAIN3-
  Top 0.305: IC101.3.1 21.43,86.7 21.9,87.18 21.9,88.76 R101.3.1 TP103.3.P$1
GAIN4+
  Top 0.305: IC101.4.8 24.28,70.67 23.81,71.14 23.81,72.73 R101.4.2 TP104.4.P$1
GAIN4-
  Top 0.305: IC101.4.1 21.43,70.67 21.9,71.14 21.9,72.73 R101.4.1 TP103.4.P$1
GAIN_B0_DO  (via drill 0.3)  (1 unrouted)
  Route2 0.406: v36.82,57.02 38.57,58.6 46.98,58.6 49.21,60.83 U11.R_PA6
  Bottom 0.406: R159.1 35.56,57.02 v36.82,57.02
GAIN_B1_DO  (via drill 0.3)
  Route2 0.406: v40.16,57.02 47.62,57.02 51.75,61.14 TP17.P$1 U11.R_PA7
  Bottom 0.406: 38.89,57.02 v40.16,57.02
  Bottom 0.61: R157.1 38.89,57.02
IN1+
  Top 0.305: IC101.1.3 18.41,52.09 17.78,51.46 JP101.1.2 13.17,51.46 | 13.17,51.46 L102.1.1 | TP102.1.P$1 13.17,51.46 | C105.1.2 13.17,51.46
IN1-
  Top 0.305: IC101.1.2 18.41,53.36 17.78,54 JP101.1.1 13.17,54 | 13.17,54 L101.1.1 | 13.17,54 C105.1.1 TP101.1.P$1
IN2+
  Top 0.305: IC101.2.3 18.41,36.06 17.78,35.42 JP101.2.2 13.17,35.42 | 13.17,35.42 L102.2.1 | 13.17,35.42 C105.2.2 TP102.2.P$1
IN2-
  Top 0.305: IC101.2.2 18.41,37.33 17.78,37.97 JP101.2.1 13.17,37.97 | 13.17,37.97 L101.2.1 | 13.17,37.97 C105.2.1 TP101.2.P$1
IN3+  (3 unrouted)
  Top 0.305: TP102.3.P$1 C105.3.2
IN3-  (3 unrouted)
  Top 0.305: TP101.3.P$1 C105.3.1
IN4+
  Top 0.305: IC101.4.3 18.41,68.13 17.78,67.49 JP101.4.2 12.85,67.49 | 12.85,67.49 L102.4.1 | TP102.4.P$1 C105.4.2 13.17,67.81 12.85,67.49
IN4-
  Top 0.305: IC101.4.2 18.41,69.4 17.78,70.03 JP101.4.1 13.17,70.03 | 13.17,70.03 L101.4.1 | 13.17,70.03 C105.4.1 TP101.4.P$1
N$3  (4 unrouted)
N$4  (3 unrouted)
N$5  (2 unrouted)
N$6  (2 unrouted)
N$7  (3 unrouted)
N$8  (3 unrouted)
N$9  (3 unrouted)
N$10  (3 unrouted)
N$11  (3 unrouted)
N$12  (3 unrouted)
N$13  (3 unrouted)
N$14  (3 unrouted)
N$15  (3 unrouted)
N$16  (3 unrouted)
N$17  (3 unrouted)
N$18  (3 unrouted)
N$19  (3 unrouted)
N$20  (3 unrouted)
N$21  (3 unrouted)
N$22  (3 unrouted)
N$23  (3 unrouted)
N$24  (3 unrouted)
N$25  (3 unrouted)
N$26  (1 unrouted)
N$27  (1 unrouted)
N$28  (1 unrouted)
N$29  (6 unrouted)
N$31  (1 unrouted)
N$32  (4 unrouted)
N$34  (1 unrouted)
N$62
  Top 0.254: 80.34,81.77 77.49,81.77 | 80.34,81.77 80.34,79.45 77.49,79.45 77.49,81.77 | 80.34,84 80.34,81.77 | 80.34,86.39 80.34,84 | 80.34,86.39 80.34,88.71 77.49,88.71 77.49,86.39 | 80.34,86.39 77.49,86.39 | 77.49,84 77.49,86.39 | 80.34,84 77.49,84 | 77.49,81.77 77.49,84
N$63
  Bottom 0.254: 80.34,81.77 77.49,81.77 | 80.34,81.77 80.34,79.45 77.49,79.45 77.49,81.77 | 80.34,84 80.34,81.77 | 80.34,86.39 80.34,84 | 80.34,86.39 80.34,88.71 77.49,88.71 77.49,86.39 | 80.34,86.39 77.49,86.39 | 77.49,84 77.49,86.39 | 80.34,84 77.49,84 | 77.49,81.77 77.49,84
N$64
  Route2 0.254: 80.34,81.77 77.49,81.77 | 80.34,81.77 80.34,79.45 77.49,79.45 77.49,81.77 | 80.34,84 80.34,81.77 | 80.34,86.39 80.34,84 | 80.34,86.39 80.34,88.71 77.49,88.71 77.49,86.39 | 80.34,86.39 77.49,86.39 | 77.49,84 77.49,86.39 | 80.34,84 77.49,84 | 77.49,81.77 77.49,84
N$65
  Route15 0.254: 80.34,81.77 77.49,81.77 | 80.34,81.77 80.34,79.45 77.49,79.45 77.49,81.77 | 80.34,84 80.34,81.77 | 80.34,86.39 80.34,84 | 80.34,86.39 80.34,88.71 77.49,88.71 77.49,86.39 | 80.34,86.39 77.49,86.39 | 77.49,84 77.49,86.39 | 80.34,84 77.49,84 | 77.49,81.77 77.49,84
PGA_DIODE1_IN  (4 unrouted)
PSU_ENABLE_DO
  Top 0.61: TP8.P$1 U11.L_PA4
PWSTG_ENABLE_DO
  Top 0.61: U11.L_PA0 TP10.P$1
PWSTG_PWR_EN_DO
  Top 0.61: TP7.P$1 73.65,6.69 74.61,5.74 U11.L_PB0
PWSTG_UVLO_DI
  Top 0.61: U11.L_PA1 TP9.P$1
RESET  (via drill 0.5)
  Top 0.305: U11.L_RESET 49.21,6.63 48.32,7.52 v39.02,7.52
  Top 0.61: S11.2 S11.1
  Route15 0.305: v39.02,7.52 36.89,7.52 36,8.41 8.35,8.41 6.54,10.21 S11.2
SD_SPI_MISO_DI  (1 unrouted)
  Top 0.305: U11.L_PC11 33.97,5.58 30.54,9.01 30.54,14.41 29.71,15.23 U21.1.2
SD_SPI_MOSI_DO  (2 unrouted)
  Top 0.305: U11.L_PC12 37.78,4.23 37.78,6.31 32.92,11.17 32.92,12.31 33.3,12.69 U21.1.5
SD_SPI_SCK_DO  (2 unrouted)
  Top 0.305: U11.L_PC10 33.97,3.67 35.24,4.95 35.24,7.33 32.09,10.47 32.09,13.07 32.98,13.96 U21.1.6
SENSE1+  (1 unrouted)
  Top 0.305: X101.1.C1 3.49,51.46 | 3.49,51.46 X101.1.C2 | 9.2,51.4 7.77,51.4 | 7.77,51.4 3.54,51.4 3.49,51.46 | 7.72,51.46 7.77,51.4
  Top 0.61: 9.46,51.45 L102.1.2 9.2,51.4
  Top 0.813: 6.03,50.35 5.71,50.66 3.96,50.66 3.96,51.43 X101.1.C2
SENSE1-  (1 unrouted)
  Top 0.305: X101.1.@GND2 2.85,55.14 X101.1.@GND1 4.25,54.5 4.76,54 | X101.1.@GND3 2.4,47.78 2.54,47.65
  Top 0.61: L101.1.2 9.36,54.05
  Bottom 0.406: 1.6,49.76 X101.1.@GND4
SENSE2+  (2 unrouted)
  Top 0.305: X101.2.C1 2.54,35.42 X101.2.C2
  Top 0.813: 6.03,34.31 5.71,34.63 4.12,34.63 4.12,35.3 X101.2.C2
SENSE2-  (1 unrouted)
  Top 0.305: 4.76,37.97 4.28,38.44 3.52,38.44 X101.2.@GND1 | 2.54,39.23 2.13,39.23 X101.2.@GND2 | 2.54,31.61 2.13,31.61 X101.2.@GND3
  Bottom 0.406: 1.6,33.73 X101.2.@GND4
SENSE3+  (2 unrouted)
  Top 0.305: X101.3.C1 3.49,83.53
  Top 0.406: 3.49,83.53 X101.3.C2
  Top 0.813: 6.03,82.42 5.71,82.73 3.96,82.73 3.96,83.5 X101.3.C2
SENSE3-  (1 unrouted)
  Top 0.305: 2.54,79.72 2.13,79.72 X101.3.@GND3 | 2.54,87.34 2.13,87.34 X101.3.@GND2
  Bottom 0.406: 1.6,81.83 X101.3.@GND4
SENSE4+  (2 unrouted)
  Top 0.305: X101.4.C1 X101.4.C2
  Top 0.813: 6.03,66.38 5.71,66.7 4.44,66.7 4.44,67.17 4.12,67.49 X101.4.C2
SENSE4-  (1 unrouted)
  Top 0.305: X101.4.@GND2 2.54,71.17 | 4.76,70.03 4.28,70.51 3.52,70.51 X101.4.@GND1 | 2.54,63.68 2.13,63.68 X101.4.@GND3
  Bottom 0.406: 1.6,65.79 X101.4.@GND4
TC1+
  Top 0.61: X301.1 L301.1.2
TC1-
  Top 0.61: X301.2 L302.1.2
TC2+
  Top 0.61: X301.3 L301.2.2
TC2-
  Top 0.61: X301.4 L302.2.2
TC3+
  Top 0.61: X302.1 L301.3.2
TC3-
  Top 0.61: X302.2 L302.3.2
TC4+
  Top 0.61: X302.3 L301.4.2
TC4-
  Top 0.61: X302.4 L302.4.2
TEMP_SPI_MISO_DI
  Top 0.3: 49.53,21.45 49.53,15.42 49.21,15.11 IC301.4.7 TP21.P$1 | 49.53,21.45 49.53,27.8 | 49.53,27.8 49.53,34.16 | IC301.1.7 49.53,34.16 | IC301.2.7 49.53,27.8 | IC301.3.7 49.53,21.45 | U11.R_PB9 39.05,63.05 39.68,62.41 41.75,62.41 49.53,54.63 49.53,34.16
TEMP_SPI_SCK_DO  (via drill 0.3)
  Top 0.3: IC301.4.5 46.03,17.64 45.71,17.96 v45.71,18.44 45.71,24 | 45.71,24 45.71,30.34 | 45.71,30.34 45.71,36.22 46.19,36.7 IC301.1.5 47.94,36.75 47.94,36.7 48.57,36.7 48.57,54.48 41.43,61.62 38.89,61.62 36.59,63.92 U11.R_PB8 | IC301.2.5 45.71,30.34 | IC301.3.5 45.71,24
  Bottom 0.3: TP20.P$1 v45.71,18.44
TIM4_CH4_DO
  Top 0.305: U11.R_PA10 73.34,65.19 TP11.P$1
TK1_N
  Top 0.61: IC301.1.2 55.24,34.16 56.51,32.88 57.78,32.88 | 57.78,32.88 L302.1.1 | C301.1.2 57.46,33.2 57.78,32.88
TK1_P
  Top 0.61: L301.1.1 57.3,35.42 | 57.3,35.42 IC301.1.3 | C301.1.1 57.3,35.01 57.3,35.42
TK2_N
  Top 0.61: L302.2.1 57.46,27.8 | 57.46,27.8 IC301.2.2 | C301.2.2 57.46,27.8
TK2_P
  Top 0.61: IC301.2.3 55.24,29.07 56.51,30.34 57.62,30.34 | 57.62,30.34 L301.2.1 | C301.2.1 57.46,30.19 57.62,30.34
TK3_N
  Top 0.61: IC301.3.2 55.24,21.45 56.51,20.18 57.46,20.18 | 57.46,20.18 L302.3.1 | C301.3.2 57.46,20.18
TK3_P
  Top 0.61: L301.3.1 57.46,22.73 | 57.46,22.73 IC301.3.3 | C301.3.1 57.46,22.73
TK4_N
  Top 0.61: L302.4.1 57.3,15.11 | 57.3,15.11 IC301.4.2 | C301.4.2 57.3,15.53 57.3,15.11
TK4_P
  Top 0.61: IC301.4.3 55.24,16.38 56.51,17.64 57.78,17.64 | 57.78,17.64 L301.4.1 | C301.4.1 57.46,17.33 57.78,17.64
TP152.1
  Top 0.305: TP152.1.P$1 40.26,50.51 R154A.2 R154B.2 R155A.2 | R155A.2 R156B.2 | R151.1.1 35.98,50.55 R155A.2
  Top 0.406: R151.1.1 35.87,48.82 IC151.1.2
V_OFF1  (via drill 0.3)  (3 unrouted)
  Top 0.3: 45.24,76.38 43.97,75.11 43.97,71.14 42.38,69.56 v30.95,69.56
  Top 0.305: R103.1.1 v30.95,50.35
  Route2 0.3: v30.95,82.42 v30.95,69.56 v30.95,66.38 | v30.95,34.31 v30.95,50.35
  Route15 0.3: v30.95,50.35 v30.95,66.38
V_OFF2_4  (5 unrouted)
V_OFFS  (4 unrouted)
V_OFFS_2_4  (4 unrouted)
V_OPREF1  (via drill 0.3)
  Top 0.305: R103.1.2 v27.14,50.35 | TP107.1.P$1 26.35,49.55 v27.14,50.35 | 25.87,50.82 26.66,50.82 v27.14,50.35
  Top 0.61: 25.87,50.82 IC101.1.5
  Bottom 0.305: v27.14,50.35 27.99,50.35 C107.1.1
V_OPREF2  (via drill 0.3)
  Top 0.305: R103.2.2 v27.14,34.31 | IC101.2.5 26.66,34.79 v27.14,34.31 | TP107.2.P$1 26.35,33.52 v27.14,34.31
  Bottom 0.305: v27.14,34.31 R103.2.2 C107.2.1
V_OPREF3  (via drill 0.3)
  Top 0.305: R103.3.2 v27.14,82.42 | IC101.3.5 26.66,82.89 v27.14,82.42 | v27.14,82.42 26.35,81.62 TP107.3.P$1
  Bottom 0.305: v27.14,82.42 27.99,82.42 C107.3.1
V_OPREF4  (via drill 0.3)
  Top 0.305: R103.4.2 v27.14,66.38 | IC101.4.5 26.66,66.86 v27.14,66.38 | TP107.4.P$1 26.35,65.59 v27.14,66.38
  Bottom 0.305: v27.14,66.38 27.99,66.38 C107.4.1
VOFFS_RR  (3 unrouted)
VOFFS_RR1  (3 unrouted)
VREF  (4 unrouted)
VREF_2V5_BUFF  (8 unrouted)
VREF_RR1  (1 unrouted)
VREF_RR2  (1 unrouted)
VREF_TRIM  (1 unrouted)
VREF_TRIM1  (1 unrouted)

## Text on the board
Top: 1
Route2: 2
Route15: 3
Bottom: 4
tPlace: OFFSET / Adjust | JLCJLCJLCJLC
tNames: I_M3 / ENABLE | I_M4 / ENABLE | T | T | J | A | P | I_M1 / ENABLE | µTTA V1.00 | + | TC1 | - | + | I_M2 / ENABLE | TC2 | - | RESET | + | TC3 | - | + | TC4 | -